# Altium project first_trail.PrjPcb
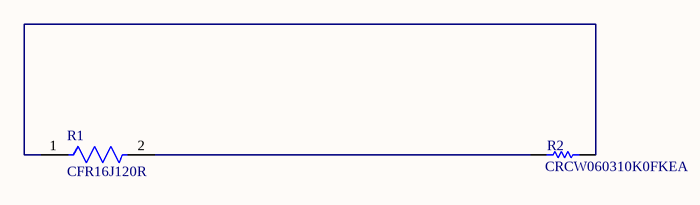
[diagram p0: Sheet1.SchDoc]
1 sheet, 2 parts. Net scope: global (net labels, ports and power ports of the same name join across sheets).
Board file: PCB1.PcbDoc

## Sheet Sheet1.SchDoc
size A; SheetNumber: 1; SheetTotal: 1

### Parts
R1  CFR16J120R  [FP-CFR16-MFG]
R2  CRCW060310K0FKEA  [RESC1609X50X30NL8T20]

### Nets
NetR1_1: R1.1 R2.2
NetR1_2: R1.2 R2.1

### Library data of the parts
R1 = CMP-03212-000007-1: RES 120 OHM 1/4W 5% AXIAL; Resistance: 120R; Power Rating: 250mW; Number of Resistors: 1; Voltage Rating: 200V; Temperature Coefficient: 0ppm/°C; RoHS Compliant: Yes; Mount: Axial; Package Quantity: 5000; Diameter: 1.85mm; Number of Terminations: 2; Packaging: Cut Tape; Max Operating Temperature: 155°C; Resistance Tolerance: 5%; Termination: Axial; Length: 3.5mm; Max Power Dissipation: 250mW; Min Operating Temperature: -55°C; Resistor Type: Thin Film; Technology: CARBON FILM; Case/Package: Axial; Tolerance: 5%; Series: CFR16, Neohm; Voltage Rating (DC): 200V; ELV: Compliant; REACH SVHC: No SVHC
R2 = CMP-1666-00005-4: Chip Resistor, 10 KOhm, +/- 1%, 100 mW, -55 to 155 degC, 0603 (1608 Metric), RoHS, Tape and Reel; Manufacturer: Vishay Semiconductor; Voltage Rating: 75 V; Max Operating Temperature: 155 degC; PackageDescription: 2-Pin Surface Mount Device, Body 1.575 x 0.85 mm; ComponentLink1Description: Manufacturer URL; RoHSCompliant: true; PackageReference: 0603; REACH SVHC: Unknown; Length: 1.55 mm; DatasheetVersion: 06/2012; Packaging: Tape and Reel; Min Operating Temperature: -55 degC; Mounting Technology: Surface Mount; ComponentLink2URL: https://datasheet.ciiva.com/11809/0900766b80d98afc-11809037.pdf; Height: 0.45 mm; ComponentLink2Description: Datasheet; Package Quantity: 5000; ComponentLink1URL: http://www.vishay.com/